# Altium schematic sheet 4501-WB-AV-BMS-REV-A2-ISOSPI.SchDoc
size A4
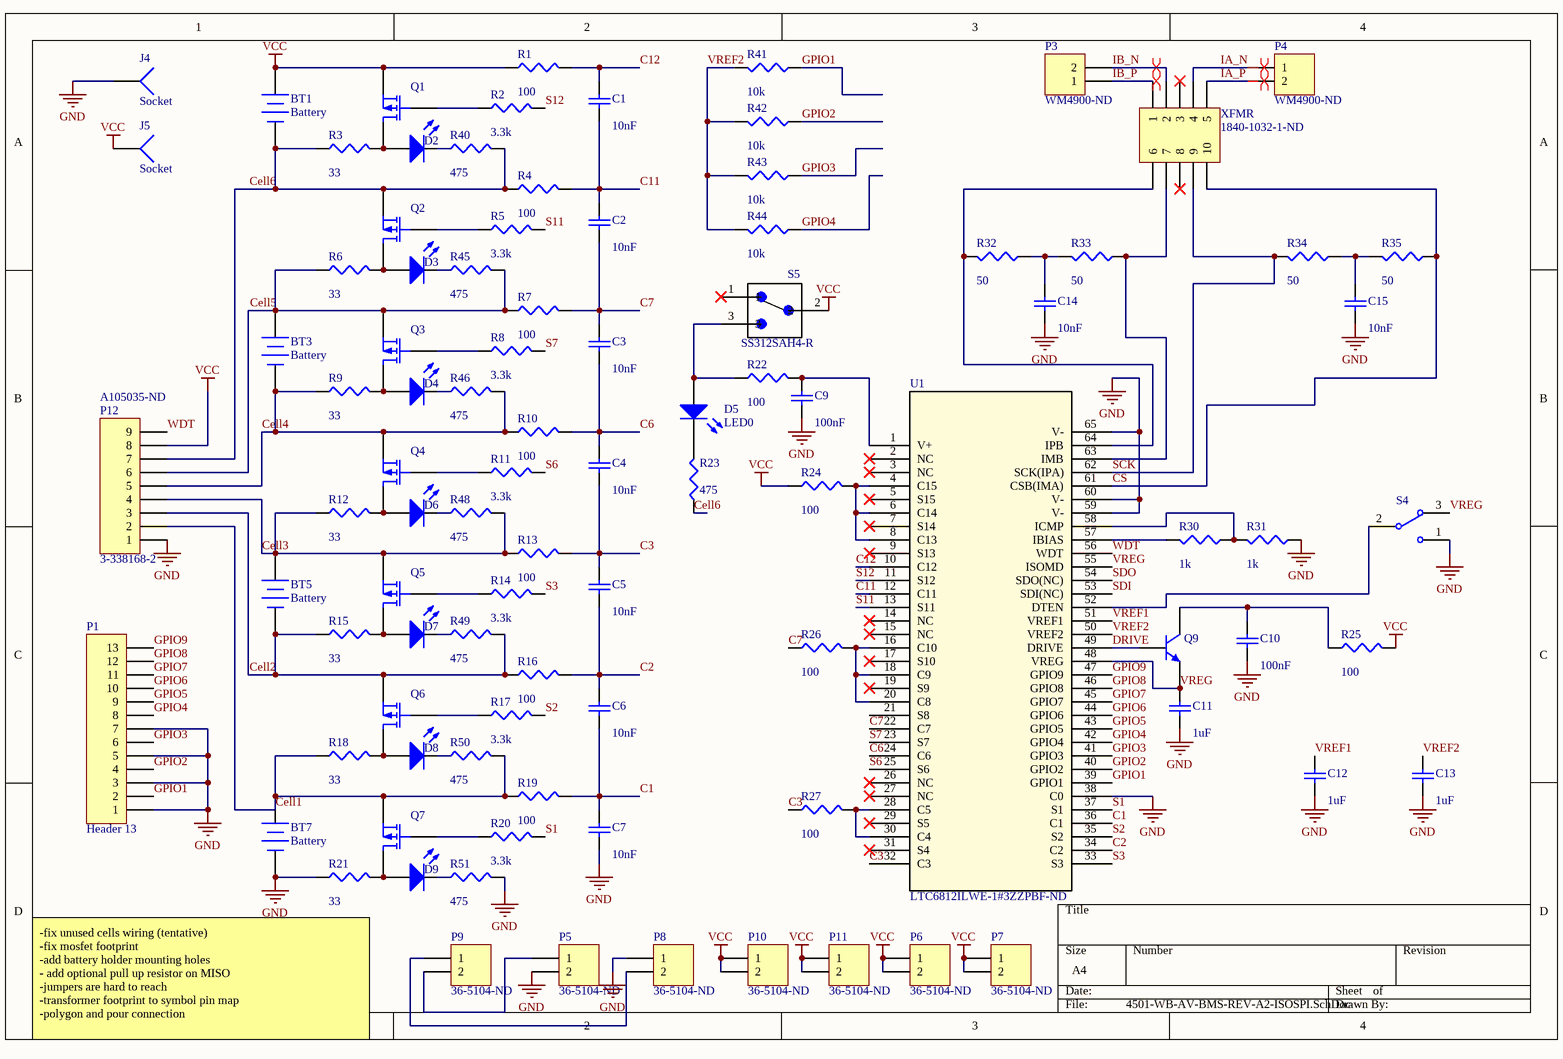
[diagram p0: 4501-WB-AV-BMS-REV-A2-ISOSPI.SchDoc]

## Parts
BT1  Battery  [PCBComponent_1]
BT3  Battery  [PCBComponent_1]
BT5  Battery  [PCBComponent_1]
BT7  Battery  [PCBComponent_1]
C1  value 10nF  [1608[0603]]  (hidden comment: 399-1092-1-ND)
C2  value 10nF  [1608[0603]]  (hidden comment: 399-1092-1-ND)
C3  value 10nF  [1608[0603]]  (hidden comment: 399-1092-1-ND)
C4  value 10nF  [1608[0603]]  (hidden comment: 399-1092-1-ND)
C5  value 10nF  [1608[0603]]  (hidden comment: 399-1092-1-ND)
C6  value 10nF  [1608[0603]]  (hidden comment: 399-1092-1-ND)
C7  value 10nF  [1608[0603]]  (hidden comment: 399-1092-1-ND)
C9  value 100nF  [6-0805_N]  (hidden comment: 1276-1090-1-ND)
C10  value 100nF  [6-0805_N]  (hidden comment: 1276-1090-1-ND)
C11  value 1uF  [6-0805_N]  (hidden comment: 311-3498-1-ND)
C12  value 1uF  [6-0805_N]  (hidden comment: 311-3498-1-ND)
C13  value 1uF  [6-0805_N]  (hidden comment: 311-3498-1-ND)
C14  value 10nF  [1608[0603]]  (hidden comment: 399-1092-1-ND)
C15  value 10nF  [1608[0603]]  (hidden comment: 399-1092-1-ND)
D2  160-1435-1-ND  [J1-0603]  (value not drawn)
D3  160-1435-1-ND  [J1-0603]  (value not drawn)
D4  160-1435-1-ND  [J1-0603]  (value not drawn)
D5  LED0  [J1-0603]
D6  160-1435-1-ND  [J1-0603]  (value not drawn)
D7  160-1435-1-ND  [J1-0603]  (value not drawn)
D8  160-1435-1-ND  [J1-0603]  (value not drawn)
D9  160-1435-1-ND  [J1-0603]  (value not drawn)
J4  Socket  [PCBComponent_1]
J5  Socket  [PCBComponent_1]
P1  Header 13  [DIP10]
P3  WM4900-ND  [WM4900-ND]
P4  WM4900-ND  [WM4900-ND]
P5  36-5104-ND  [PCBComponent_1]
P6  36-5104-ND  [PCBComponent_1]
P7  36-5104-ND  [PCBComponent_1]
P8  36-5104-ND  [PCBComponent_1]
P9  36-5104-ND  [PCBComponent_1]
P10  36-5104-ND  [PCBComponent_1]
P11  36-5104-ND  [PCBComponent_1]
P12  3-338168-2  Supplier Part Number 1: A105035-ND  [CONN_3-338168-2]
Q1  BSS308PEH6327XTSA1CT-ND  [SOT95P245X110-3N]  (value not drawn)
Q2  BSS308PEH6327XTSA1CT-ND  [SOT95P245X110-3N]  (value not drawn)
Q3  BSS308PEH6327XTSA1CT-ND  [SOT95P245X110-3N]  (value not drawn)
Q4  BSS308PEH6327XTSA1CT-ND  [SOT95P245X110-3N]  (value not drawn)
Q5  BSS308PEH6327XTSA1CT-ND  [SOT95P245X110-3N]  (value not drawn)
Q6  BSS308PEH6327XTSA1CT-ND  [SOT95P245X110-3N]  (value not drawn)
Q7  BSS308PEH6327XTSA1CT-ND  [SOT95P245X110-3N]  (value not drawn)
Q9  DXT5551P5-13CT-ND  [DXT5551P5-13]  (value not drawn)
R1  value 100  [J1-0603]  (hidden comment: A129676CT-ND)
R2  value 3.3k  [J1-0603]  (hidden comment: A129543CT-ND)
R3  value 33  [12Z-2010]  (hidden comment: A130642CT-ND)
R4  value 100  [J1-0603]  (hidden comment: A129676CT-ND)
R5  value 3.3k  [J1-0603]  (hidden comment: A129543CT-ND)
R6  value 33  [12Z-2010]  (hidden comment: A130642CT-ND)
R7  value 100  [J1-0603]  (hidden comment: A129676CT-ND)
R8  value 3.3k  [J1-0603]  (hidden comment: A129543CT-ND)
R9  value 33  [12Z-2010]  (hidden comment: A130642CT-ND)
R10  value 100  [J1-0603]  (hidden comment: A129676CT-ND)
R11  value 3.3k  [J1-0603]  (hidden comment: A129543CT-ND)
R12  value 33  [12Z-2010]  (hidden comment: A130642CT-ND)
R13  value 100  [J1-0603]  (hidden comment: A129676CT-ND)
R14  value 3.3k  [J1-0603]  (hidden comment: A129543CT-ND)
R15  value 33  [12Z-2010]  (hidden comment: A130642CT-ND)
R16  value 100  [J1-0603]  (hidden comment: A129676CT-ND)
R17  value 3.3k  [J1-0603]  (hidden comment: A129543CT-ND)
R18  value 33  [12Z-2010]  (hidden comment: A130642CT-ND)
R19  value 100  [J1-0603]  (hidden comment: A129676CT-ND)
R20  value 3.3k  [J1-0603]  (hidden comment: A129543CT-ND)
R21  value 33  [12Z-2010]  (hidden comment: A130642CT-ND)
R22  value 100  [J1-0603]  (hidden comment: A129676CT-ND)
R23  value 475  [J1-0603]  (hidden comment: RMCF2010JT33R0CT-ND)
R24  value 100  [J1-0603]  (hidden comment: A129676CT-ND)
R25  value 100  [J1-0603]  (hidden comment: A129676CT-ND)
R26  value 100  [J1-0603]  (hidden comment: A129676CT-ND)
R27  value 100  [J1-0603]  (hidden comment: A129676CT-ND)
R30  value 1k  [J1-0603]  (hidden comment: RNCP0603FTD1K00CT-ND)
R31  value 1k  [J1-0603]  (hidden comment: RNCP0603FTD1K00CT-ND)
R32  value 50  [J1-0603]  (hidden comment: 311-2598-1-ND)
R33  value 50  [J1-0603]  (hidden comment: 311-2598-1-ND)
R34  value 50  [J1-0603]  (hidden comment: 311-2598-1-ND)
R35  value 50  [J1-0603]  (hidden comment: 311-2598-1-ND)
R40  value 475  [J1-0603]  (hidden comment: RMCF2010JT33R0CT-ND)
R41  value 10k  [J1-0603]  (hidden comment: RNCP0603FTD10K0CT-ND)
R42  value 10k  [J1-0603]  (hidden comment: RNCP0603FTD10K0CT-ND)
R43  value 10k  [J1-0603]  (hidden comment: RNCP0603FTD10K0CT-ND)
R44  value 10k  [J1-0603]  (hidden comment: RNCP0603FTD10K0CT-ND)
R45  value 475  [J1-0603]  (hidden comment: RMCF2010JT33R0CT-ND)
R46  value 475  [J1-0603]  (hidden comment: RMCF2010JT33R0CT-ND)
R48  value 475  [J1-0603]  (hidden comment: RMCF2010JT33R0CT-ND)
R49  value 475  [J1-0603]  (hidden comment: RMCF2010JT33R0CT-ND)
R50  value 475  [J1-0603]  (hidden comment: RMCF2010JT33R0CT-ND)
R51  value 475  [J1-0603]  (hidden comment: RMCF2010JT33R0CT-ND)
S4  S9337-ND, SAM8981-ND  [*TSM-103-01-L-SV]  (value not drawn)
S5  SS312SAH4-R  [*SW_SS312SAH4-R]
U1  LTC6812ILWE-1#3ZZPBF-ND  [LQFP64_LWE_A - duplicate]
XFMR  1840-1032-1-ND  [HM2100NLT]

## Nets
GND: BT7.2(-) C7.1 C9.1 C10.1 C11.1 C12.1 C13.1 C14.1 C15.1 J4.1 P1.1 P1.3 P1.5 P1.7 P5.2 P8.1 P12.1 R21.2 R31.2 R51.1 S4.1 U1.38(C0) U1.59(V-) U1.60(V-) U1.65(V-)
VCC: BT1.1(+) J5.1 P6.1 P6.2 P7.1 P7.2 P10.1 P10.2 P11.1 P11.2 P12.8 Q1.3(S) R1.1 R24.1 R25.2 S5.2
C1: C6.1 C7.2 R19.2 U1.36(C1)
C2: C5.1 C6.2 R16.2 U1.34(C2)
C3: C4.1 C5.2 R13.2 R27.1 U1.32(C3)
C6: C3.1 C4.2 R10.2 U1.24(C6)
C7: C2.1 C3.2 R7.2 R26.1 U1.22(C7)
C11: C1.1 C2.2 R4.2 U1.12(C11)
C12: C1.2 R1.2 U1.10(C12)
Cell1: BT7.1(+) P12.2 Q7.3(S) R18.2 R19.1 R50.1
Cell2: BT5.2(-) P12.3 Q6.3(S) R15.2 R16.1 R49.1
Cell3: BT5.1(+) P12.4 Q5.3(S) R12.2 R13.1 R48.1
Cell4: BT3.2(-) P12.5 Q4.3(S) R9.2 R10.1 R46.1
Cell5: BT3.1(+) P12.6 Q3.3(S) R6.2 R7.1 R45.1
Cell6: BT1.2(-) P12.7 Q2.3(S) R3.2 R4.1 R23.2 R40.1
CS: R35.2 U1.61(CSB(IMA)) XFMR.10
DRIVE: Q9.2(B) U1.49(DRIVE)
GPIO1: P1.2 R41.2 U1.39(GPIO1)
GPIO2: P1.4 R42.2 U1.40(GPIO2)
GPIO3: P1.6 R43.2 U1.41(GPIO3)
GPIO4: P1.8 R44.2 U1.42(GPIO4)
GPIO5: P1.9 U1.43(GPIO5)
GPIO6: P1.10 U1.44(GPIO6)
GPIO7: P1.11 U1.45(GPIO7)
GPIO8: P1.12 U1.46(GPIO8)
GPIO9: P1.13 U1.47(GPIO9)
IA_N: P4.1 XFMR.4
IA_P: P4.2 XFMR.5
IB_N: P3.2 XFMR.2
IB_P: P3.1 XFMR.1
S1: R20.2 U1.37(S1)
S2: R17.2 U1.35(S2)
S3: R14.2 U1.33(S3)
S6: R11.2 U1.25(S6)
S7: R8.2 U1.23(S7)
S11: R5.2 U1.13(S11)
S12: R2.2 U1.11(S12)
SCK: R34.1 U1.62(SCK(IPA)) XFMR.9
SDI: U1.53(SDI(NC))
SDO: U1.54(SDO(NC))
VREF1: C12.2 U1.51(VREF1)
VREF2: C13.2 R41.1 R42.1 R43.1 R44.1 U1.50(VREF2)
VREG: C11.2 Q9.1(E) S4.3 U1.48(VREG) U1.55(ISOMD)
WDT: P12.9 U1.56(WDT)
NetC9_2: C9.2 R22.1 U1.1(V+)
NetC10_2: C10.2 Q9.3(C) R25.1
NetC14_2: C14.2 R32.2 R33.1
NetC15_2: C15.2 R34.2 R35.1
NetD2_1: D2.1(A) Q1.1(D) R3.1
NetD2_2: D2.2(K) R40.2
NetD3_1: D3.1(A) Q2.1(D) R6.1
NetD3_2: D3.2(K) R45.2
NetD4_1: D4.1(A) Q3.1(D) R9.1
NetD4_2: D4.2(K) R46.2
NetD5_1: D5.1(A) R22.2 S5.3
NetD5_2: D5.2(K) R23.1
NetD6_1: D6.1(A) Q4.1(D) R12.1
NetD6_2: D6.2(K) R48.2
NetD7_1: D7.1(A) Q5.1(D) R15.1
NetD7_2: D7.2(K) R49.2
NetD8_1: D8.1(A) Q6.1(D) R18.1
NetD8_2: D8.2(K) R50.2
NetD9_1: D9.1(A) Q7.1(D) R21.1
NetD9_2: D9.2(K) R51.2
NetP5_1: P5.1 P9.2
NetP8_2: P8.2 P9.1
NetQ1_2: Q1.2(G) R2.1
NetQ2_2: Q2.2(G) R5.1
NetQ3_2: Q3.2(G) R8.1
NetQ4_2: Q4.2(G) R11.1
NetQ5_2: Q5.2(G) R14.1
NetQ6_2: Q6.2(G) R17.1
NetQ7_2: Q7.2(G) R20.1
NetR24_2: R24.2 U1.4(C15) U1.6(C14) U1.8(C13)
NetR26_2: R26.2 U1.16(C10) U1.18(C9) U1.20(C8)
NetR27_2: R27.2 U1.28(C5) U1.30(C4)
NetR30_1: R30.1 U1.57(IBIAS)
NetR30_2: R30.2 R31.1 U1.58(ICMP)
NetR32_1: R32.1 U1.64(IPB) XFMR.6
NetR33_2: R33.2 U1.63(IMB) XFMR.7
NetS4_2: S4.2 U1.52(DTEN)

Not connected (* = marked no-connect by the designer): S5 1*; U1 2(NC)* 3(NC)* 5(S15)* 7(S14)* 9(S13)* 14(NC)* 15(NC)* 17(S10)* 19(S9)* 21(S8) 26(NC)* 27(NC)* 29(S5)* 31(S4)*; XFMR 3* 8*

## Layout directives
differential pair: IA_N, IA_P, IB_N, IB_P

## Notes on the sheet
- -fix unused cells wiring (tentative)
  -fix mosfet footprint
  -add battery holder mounting holes
  - add optional pull up resistor on MISO
  -jumpers are hard to reach
  -transformer footprint to symbol pin map
  -polygon and pour connection

## Library data of the parts
BT1 BT3 BT5 BT7 = Battery: Multicell Battery; Published: 24-Mar-1999; LatestRevisionDate: 17-Jul-2002; LatestRevisionNote: Re-released for DXP Platform.; PackageReference: BAT-2; Publisher: Altium Limited; PackageDescription: Battery; 2 Leads
C1-C7 C9-C15 = Cap Semi: Capacitor (Semiconductor SIM Model); Published: 8-Jun-2000; LatestRevisionDate: 29-May-2009; LatestRevisionNote: IPC-7351 Footprint Added.; PackageReference: C1206; Publisher: Altium Limited; PackageDescription: Chip Capacitor
  C1-C7 C14 C15: SPN: 399-1092-1-ND
  C9 C10: SPN: 1276-1090-1-ND
  C11-C13: SPN: 311-3498-1-ND
D2-D4 D6-D9 = LED0: Typical INFRARED GaAs LED; Published: 8-Jun-2000; LatestRevisionDate: 08-Jul-2005; LatestRevisionNote: Mech Layer 1 removed.; PackageReference: LED-0; Publisher: Altium Limited; PackageDescription: LED; 2 Leads; SPN: 160-1435-1-ND
D5 = LED0: Typical INFRARED GaAs LED; SPN: 160-1646-1-ND; Published: 8-Jun-2000; LatestRevisionDate: 08-Jul-2005; LatestRevisionNote: Mech Layer 1 removed.; PackageReference: LED-0; Publisher: Altium Limited; PackageDescription: LED; 2 Leads
P1 = Header 13: Header, 13-Pin; LatestRevisionDate: 17-Jul-2002; LatestRevisionNote: Re-released for DXP Platform.; Publisher: Altium Limited
P3-P11 = Header 2: Header, 2-Pin; LatestRevisionDate: 17-Jul-2002; LatestRevisionNote: Re-released for DXP Platform.; Publisher: Altium Limited
  P3 P4: SPN: WM4900-ND
  P5-P11: SPN: 36-5104-ND
P12 = Header 9: Header, 9-Pin; LatestRevisionDate: 17-Jul-2002; LatestRevisionNote: Re-released for DXP Platform.; Publisher: Altium Limited; MPN: 3-338168-2; SPN: A105035-ND; Supplier 1: Digi-Key
Q1-Q7 = MOSFET-P: P-Channel MOSFET; pin to pad: 1>3 2>1 3>2; Published: 8-Jun-2000; LatestRevisionDate: 17-Jul-2002; LatestRevisionNote: Re-released for DXP Platform.; PackageVersion: 1995/1996; PackageReference: E3; Publisher: Altium Limited; PackageDescription: TO, Flat Index; 3 In-Line, Axial Leads; Body Dia. 4.6mm; Lead Dia. 0.5 mm (max); SPN: BSS308PEH6327XTSA1CT-ND
Q9 = 2N3904: NPN General Purpose Amplifier; Published: 8-Jun-2000; LatestRevisionDate: 15-Jan-2003; LatestRevisionNote: PCB Footprint 'BCY-W3/D4.7' replaced; DatasheetVersion: 1997; PackageVersion: Sep-1998; PackageReference: TO-92A; Publisher: Altium Limited; PackageDescription: TO, Flat Index; 3 In-Line, Axial Leads; Body Dia. 4.5mm; Leads 0.51 x 0.48 mm (max); ComponentLink1Description: Manufacturer Link; ComponentLink1URL: http://www.fairchildsemi.com/; ComponentLink2Description: Datasheet; ComponentLink2URL: http://www.fairchildsemi.com/ds/2N%2F2N3904.pdf; SPN: DXT5551P5-13CT-ND
R1-R27 R30-R35 R40-R46 R48-R51 = Res3: Resistor; Published: 8-Jun-2000; LatestRevisionDate: 29-May-2009; LatestRevisionNote: IPC-7351 Footprint Added.; PackageReference: J1-0603; Publisher: Altium Limited; PackageDescription: Chip Resistor
  R1 R4 R7 R10 R13 R16 R19 R22 R24 R25 R27: Parameter 1: A129676CT-ND; SPN: A129676CT-ND
  R2 R5 R8 R11 R14 R17 R20: SPN: A129543CT-ND
  R3 R6 R9 R12 R15 R18 R21: SPN: A130642CT-ND
  R23 R40 R45 R46 R48-R51: SPN: RMCF2010JT33R0CT-ND
  R26: SPN: A129676CT-ND
  R30 R31: SPN: RNCP0603FTD1K00CT-ND
  R32-R35: SPN: 311-2598-1-ND
  R41-R44: SPN: RNCP0603FTD10K0CT-ND
S4 = SW-SPDT: SPDT Subminiature Toggle Switch, Right Angle Mounting, Vertical Actuation; Published: 24-Mar-1999; LatestRevisionDate: 17-Dec-2003; LatestRevisionNote: Schematic revised, PCB Footprint replaced.; DatasheetVersion: 05-Dec-2000; PackageReference: TL36WW15050; Publisher: Altium Limited; PackageDescription: Switch; 4 Leads; ComponentLink1Description: Manufacturer Link; ComponentLink1URL: http://www.apem.com; SPN: S9337-ND, SAM8981-ND
S5 = SS312SAH4-R: Switch Slide ON None ON SPDT Side Slide 0.1A 28VAC 28VDC 0.4VA 10000Cycles Gull Wing SMD T/R; MF: NKK Switches; SPN: ‎360-2924-1-ND‎; Package: None; MP: SS312SAH4-R; SnapEDA_Link: https://www.snapeda.com/parts/SS312SAH4-R/NKK%20Switches/view-part/?ref=snap; Price: None; Availability: Unavailable; Value: *
U1 = LTC6812HLWE-1: No Description Available; Copyright: Copyright (C) 2018 Accelerated Designs. All rights reserved; RefDes: RefDes; Type: DEV; Value: Value; SPN: LTC6812ILWE-1#3ZZPBF-ND
XFMR = Header 5X2A: Header, 5-Pin, Dual row / HM2100NLT; LatestRevisionDate: 17-Jul-2002; LatestRevisionNote: Re-released for DXP Platform.; Publisher: Altium Limited; SPN: 1840-1032-1-ND
J4 J5 = Socket: LatestRevisionDate: 17-Jul-2002; LatestRevisionNote: Re-released for DXP Platform.; Publisher: Altium Limited